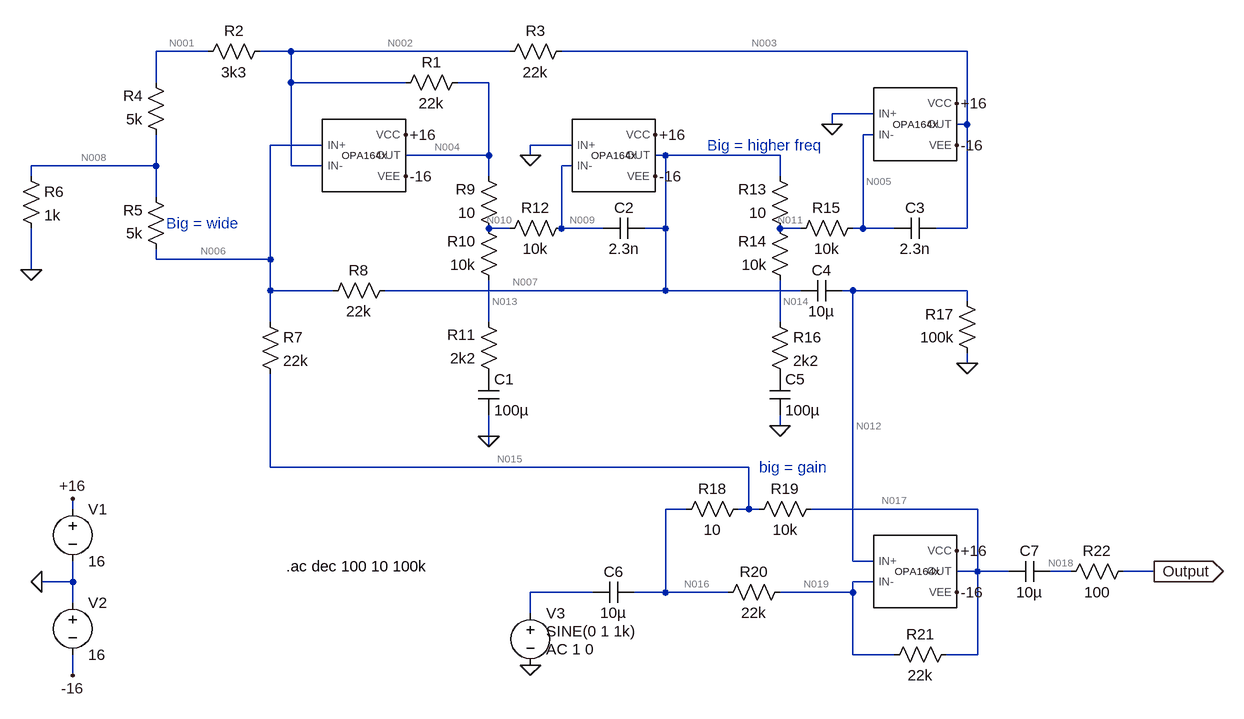
[diagram p0: schematic BandB.asc]
BandB.asc, the LTspice schematic file:
Version 4.1
SHEET 1 1312 680
WIRE -400 -368 -480 -368
WIRE -272 -368 -320 -368
WIRE 64 -368 -272 -368
WIRE 768 -368 144 -368
WIRE -480 -320 -480 -368
WIRE -272 -320 -272 -368
WIRE -96 -320 -272 -320
WIRE 32 -320 -16 -320
WIRE 624 -272 560 -272
WIRE 560 -256 560 -272
WIRE 768 -256 768 -368
WIRE 768 -256 752 -256
WIRE 624 -240 608 -240
WIRE -224 -224 -304 -224
WIRE 160 -224 96 -224
WIRE 32 -208 32 -320
WIRE 32 -208 -96 -208
WIRE 96 -208 96 -224
WIRE 304 -208 288 -208
WIRE 480 -208 304 -208
WIRE -480 -192 -480 -240
WIRE -480 -192 -672 -192
WIRE -272 -192 -272 -320
WIRE -224 -192 -272 -192
WIRE 160 -192 144 -192
WIRE -672 -176 -672 -192
WIRE 32 -176 32 -208
WIRE 480 -176 480 -208
WIRE -480 -144 -480 -192
WIRE 64 -96 32 -96
WIRE 144 -96 144 -192
WIRE 208 -96 144 -96
WIRE 304 -96 304 -208
WIRE 304 -96 272 -96
WIRE 512 -96 480 -96
WIRE 608 -96 608 -240
WIRE 608 -96 592 -96
WIRE 656 -96 608 -96
WIRE 768 -96 768 -256
WIRE 768 -96 720 -96
WIRE -480 -48 -480 -64
WIRE -304 -48 -304 -224
WIRE -304 -48 -480 -48
WIRE -672 -32 -672 -96
WIRE -304 0 -304 -48
WIRE -208 0 -304 0
WIRE 304 0 304 -96
WIRE 304 0 -128 0
WIRE 512 0 304 0
WIRE 592 0 576 0
WIRE 768 0 592 0
WIRE 768 16 768 0
WIRE -304 48 -304 0
WIRE 32 48 32 -16
WIRE 480 48 480 -16
WIRE 768 112 768 96
WIRE 480 208 480 192
WIRE 32 224 32 192
WIRE 32 240 32 224
WIRE -304 272 -304 128
WIRE 432 272 -304 272
WIRE -608 336 -608 320
WIRE 336 336 304 336
WIRE 432 336 432 272
WIRE 432 336 416 336
WIRE 448 336 432 336
WIRE 784 336 528 336
WIRE 592 416 592 0
WIRE 624 416 592 416
WIRE 784 432 784 336
WIRE 784 432 752 432
WIRE 832 432 784 432
WIRE 928 432 896 432
WIRE 1056 432 1008 432
WIRE -608 448 -608 416
WIRE -608 448 -656 448
WIRE 624 448 592 448
WIRE 192 464 96 464
WIRE 304 464 304 336
WIRE 304 464 256 464
WIRE 400 464 304 464
WIRE 592 464 592 448
WIRE 592 464 480 464
WIRE -608 480 -608 448
WIRE 96 496 96 464
WIRE 592 560 592 464
WIRE 656 560 592 560
WIRE 784 560 784 432
WIRE 784 560 736 560
WIRE -608 592 -608 560
FLAG -672 -32 0
FLAG 96 -208 0
FLAG 32 224 0
FLAG 480 208 0
FLAG 768 112 0
FLAG 1056 432 Output
IOPIN 1056 432 Out
FLAG 560 -256 0
FLAG -656 448 0
FLAG -608 320 +16
FLAG -96 -240 +16
FLAG 288 -240 +16
FLAG 752 -288 +16
FLAG 752 400 +16
FLAG -608 592 -16
FLAG -96 -176 -16
FLAG 288 -176 -16
FLAG 752 -224 -16
FLAG 752 464 -16
FLAG 96 576 0
SYMBOL BandA\\OPA164x -160 -208 R0
WINDOW 0 0 0 Invisible 0
WINDOW 3 0 0 Center 1
SYMATTR InstName U1
SYMATTR ModelFile C:\Users\ebul0\Downloads\sbom627d\OPA164x.LIB
SYMBOL BandA\\OPA164x 224 -208 R0
WINDOW 0 0 0 Invisible 0
WINDOW 3 0 0 Center 1
SYMATTR InstName U2
SYMATTR ModelFile C:\Users\ebul0\Downloads\sbom627d\OPA164x.LIB
SYMBOL BandA\\OPA164x 688 -256 R0
WINDOW 0 0 0 Invisible 0
WINDOW 3 0 0 Center 1
SYMATTR InstName U3
SYMATTR ModelFile C:\Users\ebul0\Downloads\sbom627d\OPA164x.LIB
SYMBOL BandA\\OPA164x 688 432 R0
WINDOW 3 3 0 Center 1
WINDOW 0 0 0 Invisible 0
SYMATTR InstName U4
SYMATTR ModelFile C:\Users\ebul0\Downloads\sbom627d\OPA164x.LIB
SYMBOL res 0 -336 R90
WINDOW 0 0 56 VBottom 2
WINDOW 3 32 56 VTop 2
SYMATTR InstName R1
SYMATTR Value 22k
SYMBOL res -304 -384 R90
WINDOW 0 0 56 VBottom 2
WINDOW 3 32 56 VTop 2
SYMATTR InstName R2
SYMATTR Value 3k3
SYMBOL res 160 -384 R90
WINDOW 0 0 56 VBottom 2
WINDOW 3 32 56 VTop 2
SYMATTR InstName R3
SYMATTR Value 22k
SYMBOL res -464 -224 R180
WINDOW 0 36 76 Left 2
WINDOW 3 36 40 Left 2
SYMATTR InstName R4
SYMATTR Value 5k
SYMBOL res -464 -48 R180
WINDOW 0 36 76 Left 2
WINDOW 3 36 40 Left 2
SYMATTR InstName R5
SYMATTR Value 5k
SYMBOL res -688 -192 R0
SYMATTR InstName R6
SYMATTR Value 1k
SYMBOL res -320 32 R0
SYMATTR InstName R7
SYMATTR Value 22k
SYMBOL res -112 -16 R90
WINDOW 0 0 56 VBottom 2
WINDOW 3 32 56 VTop 2
SYMATTR InstName R8
SYMATTR Value 22k
SYMBOL res 48 -80 R180
WINDOW 0 36 76 Left 2
WINDOW 3 36 40 Left 2
SYMATTR InstName R9
SYMATTR Value 10
SYMBOL res 48 0 R180
WINDOW 0 36 76 Left 2
WINDOW 3 36 40 Left 2
SYMATTR InstName R10
SYMATTR Value 10k
SYMBOL res 48 144 R180
WINDOW 0 36 76 Left 2
WINDOW 3 36 40 Left 2
SYMATTR InstName R11
SYMATTR Value 2k2
SYMBOL cap 16 128 R0
SYMATTR InstName C1
SYMATTR Value 100µ
SYMBOL cap 272 -112 R90
WINDOW 0 0 32 VBottom 2
WINDOW 3 32 32 VTop 2
SYMATTR InstName C2
SYMATTR Value 2.3n
SYMBOL res 160 -112 R90
WINDOW 0 0 56 VBottom 2
WINDOW 3 32 56 VTop 2
SYMATTR InstName R12
SYMATTR Value 10k
SYMBOL res 496 -80 R180
WINDOW 0 36 76 Left 2
WINDOW 3 36 40 Left 2
SYMATTR InstName R13
SYMATTR Value 10
SYMBOL res 496 0 R180
WINDOW 0 36 76 Left 2
WINDOW 3 36 40 Left 2
SYMATTR InstName R14
SYMATTR Value 10k
SYMBOL res 608 -112 R90
WINDOW 0 0 56 VBottom 2
WINDOW 3 32 56 VTop 2
SYMATTR InstName R15
SYMATTR Value 10k
SYMBOL cap 720 -112 R90
WINDOW 0 0 32 VBottom 2
WINDOW 3 32 32 VTop 2
SYMATTR InstName C3
SYMATTR Value 2.3n
SYMBOL cap 576 -16 R90
WINDOW 0 0 32 VBottom 2
WINDOW 3 32 32 VTop 2
SYMATTR InstName C4
SYMATTR Value 10µ
SYMBOL res 464 32 R0
SYMATTR InstName R16
SYMATTR Value 2k2
SYMBOL cap 464 128 R0
SYMATTR InstName C5
SYMATTR Value 100µ
SYMBOL res 784 112 R180
WINDOW 0 36 76 Left 2
WINDOW 3 36 40 Left 2
SYMATTR InstName R17
SYMATTR Value 100k
SYMBOL res 432 320 R90
WINDOW 0 0 56 VBottom 2
WINDOW 3 32 56 VTop 2
SYMATTR InstName R18
SYMATTR Value 10
SYMBOL res 544 320 R90
WINDOW 0 0 56 VBottom 2
WINDOW 3 32 56 VTop 2
SYMATTR InstName R19
SYMATTR Value 10k
SYMBOL res 496 448 R90
WINDOW 0 0 56 VBottom 2
WINDOW 3 32 56 VTop 2
SYMATTR InstName R20
SYMATTR Value 22k
SYMBOL res 752 544 R90
WINDOW 0 0 56 VBottom 2
WINDOW 3 32 56 VTop 2
SYMATTR InstName R21
SYMATTR Value 22k
SYMBOL cap 256 448 R90
WINDOW 0 0 32 VBottom 2
WINDOW 3 32 32 VTop 2
SYMATTR InstName C6
SYMATTR Value 10µ
SYMBOL cap 896 416 R90
WINDOW 0 0 32 VBottom 2
WINDOW 3 32 32 VTop 2
SYMATTR InstName C7
SYMATTR Value 10µ
SYMBOL res 1024 416 R90
WINDOW 0 0 56 VBottom 2
WINDOW 3 32 56 VTop 2
SYMATTR InstName R22
SYMATTR Value 100
SYMBOL voltage -608 320 R0
WINDOW 123 0 0 Left 0
WINDOW 39 0 0 Left 0
SYMATTR InstName V1
SYMATTR Value 16
SYMBOL voltage -608 464 R0
WINDOW 123 0 0 Left 0
WINDOW 39 0 0 Left 0
SYMATTR InstName V2
SYMATTR Value 16
SYMBOL voltage 96 480 R0
WINDOW 3 24 44 Left 2
WINDOW 123 24 72 Left 2
WINDOW 39 0 0 Left 0
SYMATTR Value SINE(0 1 1k)
SYMATTR Value2 AC 1 0
SYMATTR InstName V3
TEXT -280 424 Left 2 !.ac dec 100 10 100k
TEXT -464 -104 Left 2 ;Big = wide
TEXT 368 -224 Left 2 ;Big = higher freq
TEXT 448 272 Left 2 ;big = gain

The netlist it stands for:
* BandB.asc
X§U1 N006 N002 +16 -16 N004 OPA164x  ; pins IN+ IN- VCC VEE OUT
X§U2 0 N009 +16 -16 N007 OPA164x  ; pins IN+ IN- VCC VEE OUT
X§U3 0 N005 +16 -16 N003 OPA164x  ; pins IN+ IN- VCC VEE OUT
X§U4 N012 N019 +16 -16 N017 OPA164x  ; pins IN+ IN- VCC VEE OUT
R1 N004 N002 22k
R2 N002 N001 3k3
R3 N003 N002 22k
R4 N008 N001 5k
R5 N006 N008 5k
R6 N008 0 1k
R7 N006 N015 22k
R8 N007 N006 22k
R9 N010 N004 10
R10 N013 N010 10k
R11 P001 N013 2k2
C1 P001 0 100µ
C2 N007 N009 2.3n
R12 N009 N010 10k
R13 N011 N007 10
R14 N014 N011 10k
R15 N005 N011 10k
C3 N003 N005 2.3n
C4 N012 N007 10µ
R16 N014 P002 2k2
C5 P002 0 100µ
R17 0 N012 100k
R18 N015 N016 10
R19 N017 N015 10k
R20 N019 N016 22k
R21 N017 N019 22k
C6 N016 N020 10µ
C7 N018 N017 10µ
R22 Output N018 100
V1 +16 0 16
V2 0 -16 16
V3 N020 0 SINE(0 1 1k) AC 1 0
.ac dec 100 10 100k
* Big = wide
* Big = higher freq
* big = gain
.lib C:\Users\ebul0\Downloads\sbom627d\OPA164x.LIB
.backanno
.end

* Results of the author's LTspice run, read from the files saved beside the schematic
* Operating Point, zero values left out:
*   V(+16) = 16 V
*   V(-16) = -16 V
*   V(n001) = 941.8 µV
*   V(n002) = 1.434 mV
*   V(n003) = 5.147 mV
*   V(n004) = 999.9 µV
*   V(n005) = 999.9 µV
*   V(n006) = 433.7 µV
*   V(n007) = 999.9 µV
*   V(n008) = 196.5 µV
*   V(n009) = 999.9 µV
*   V(n010) = 999.9 µV
*   V(n011) = 999.9 µV
*   V(n012) = -200 nV
*   V(n013) = 999.9 µV
*   V(n014) = 999.9 µV
*   V(n015) = 911.3 µV
*   V(n016) = 911.3 µV
*   V(n017) = 1.088 mV
*   V(n018) = 1.088 mV
*   V(n019) = 999.7 µV
*   V(output) = 1.088 mV
*   V(p001) = 999.9 µV
*   V(p002) = 999.9 µV
*   I(R1) = -19.71 nA
*   I(R17) = 2 pA
*   I(R18) = -4.019 nA
*   I(R19) = 17.69 nA
*   I(R2) = 149.1 nA
*   I(R20) = 4.019 nA
*   I(R21) = 4.019 nA
*   I(R3) = 168.8 nA
*   I(R4) = -149.1 nA
*   I(R5) = 47.44 nA
*   I(R6) = 196.5 nA
*   I(R7) = -21.71 nA
*   I(R8) = 25.74 nA
*   I(V1) = -7.2 mA
*   I(V2) = -7.2 mA
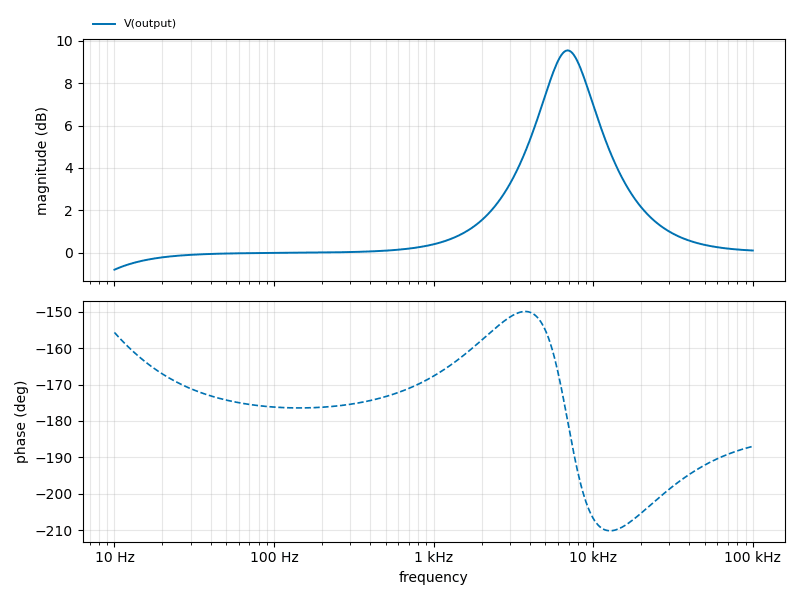
[diagram p1: AC Analysis of BandB.asc, plotted from the saved traces]
* AC Analysis, 1 run:
*   V(output): -0.80 dB at 10 Hz, 0.10 dB at 100 kHz, peak 9.55 dB at 6.918 kHz, 3 dB below the peak at 4.574 kHz and 10.45 kHz